# Altium project Thermostat.PrjPCB (part 4 of 4)
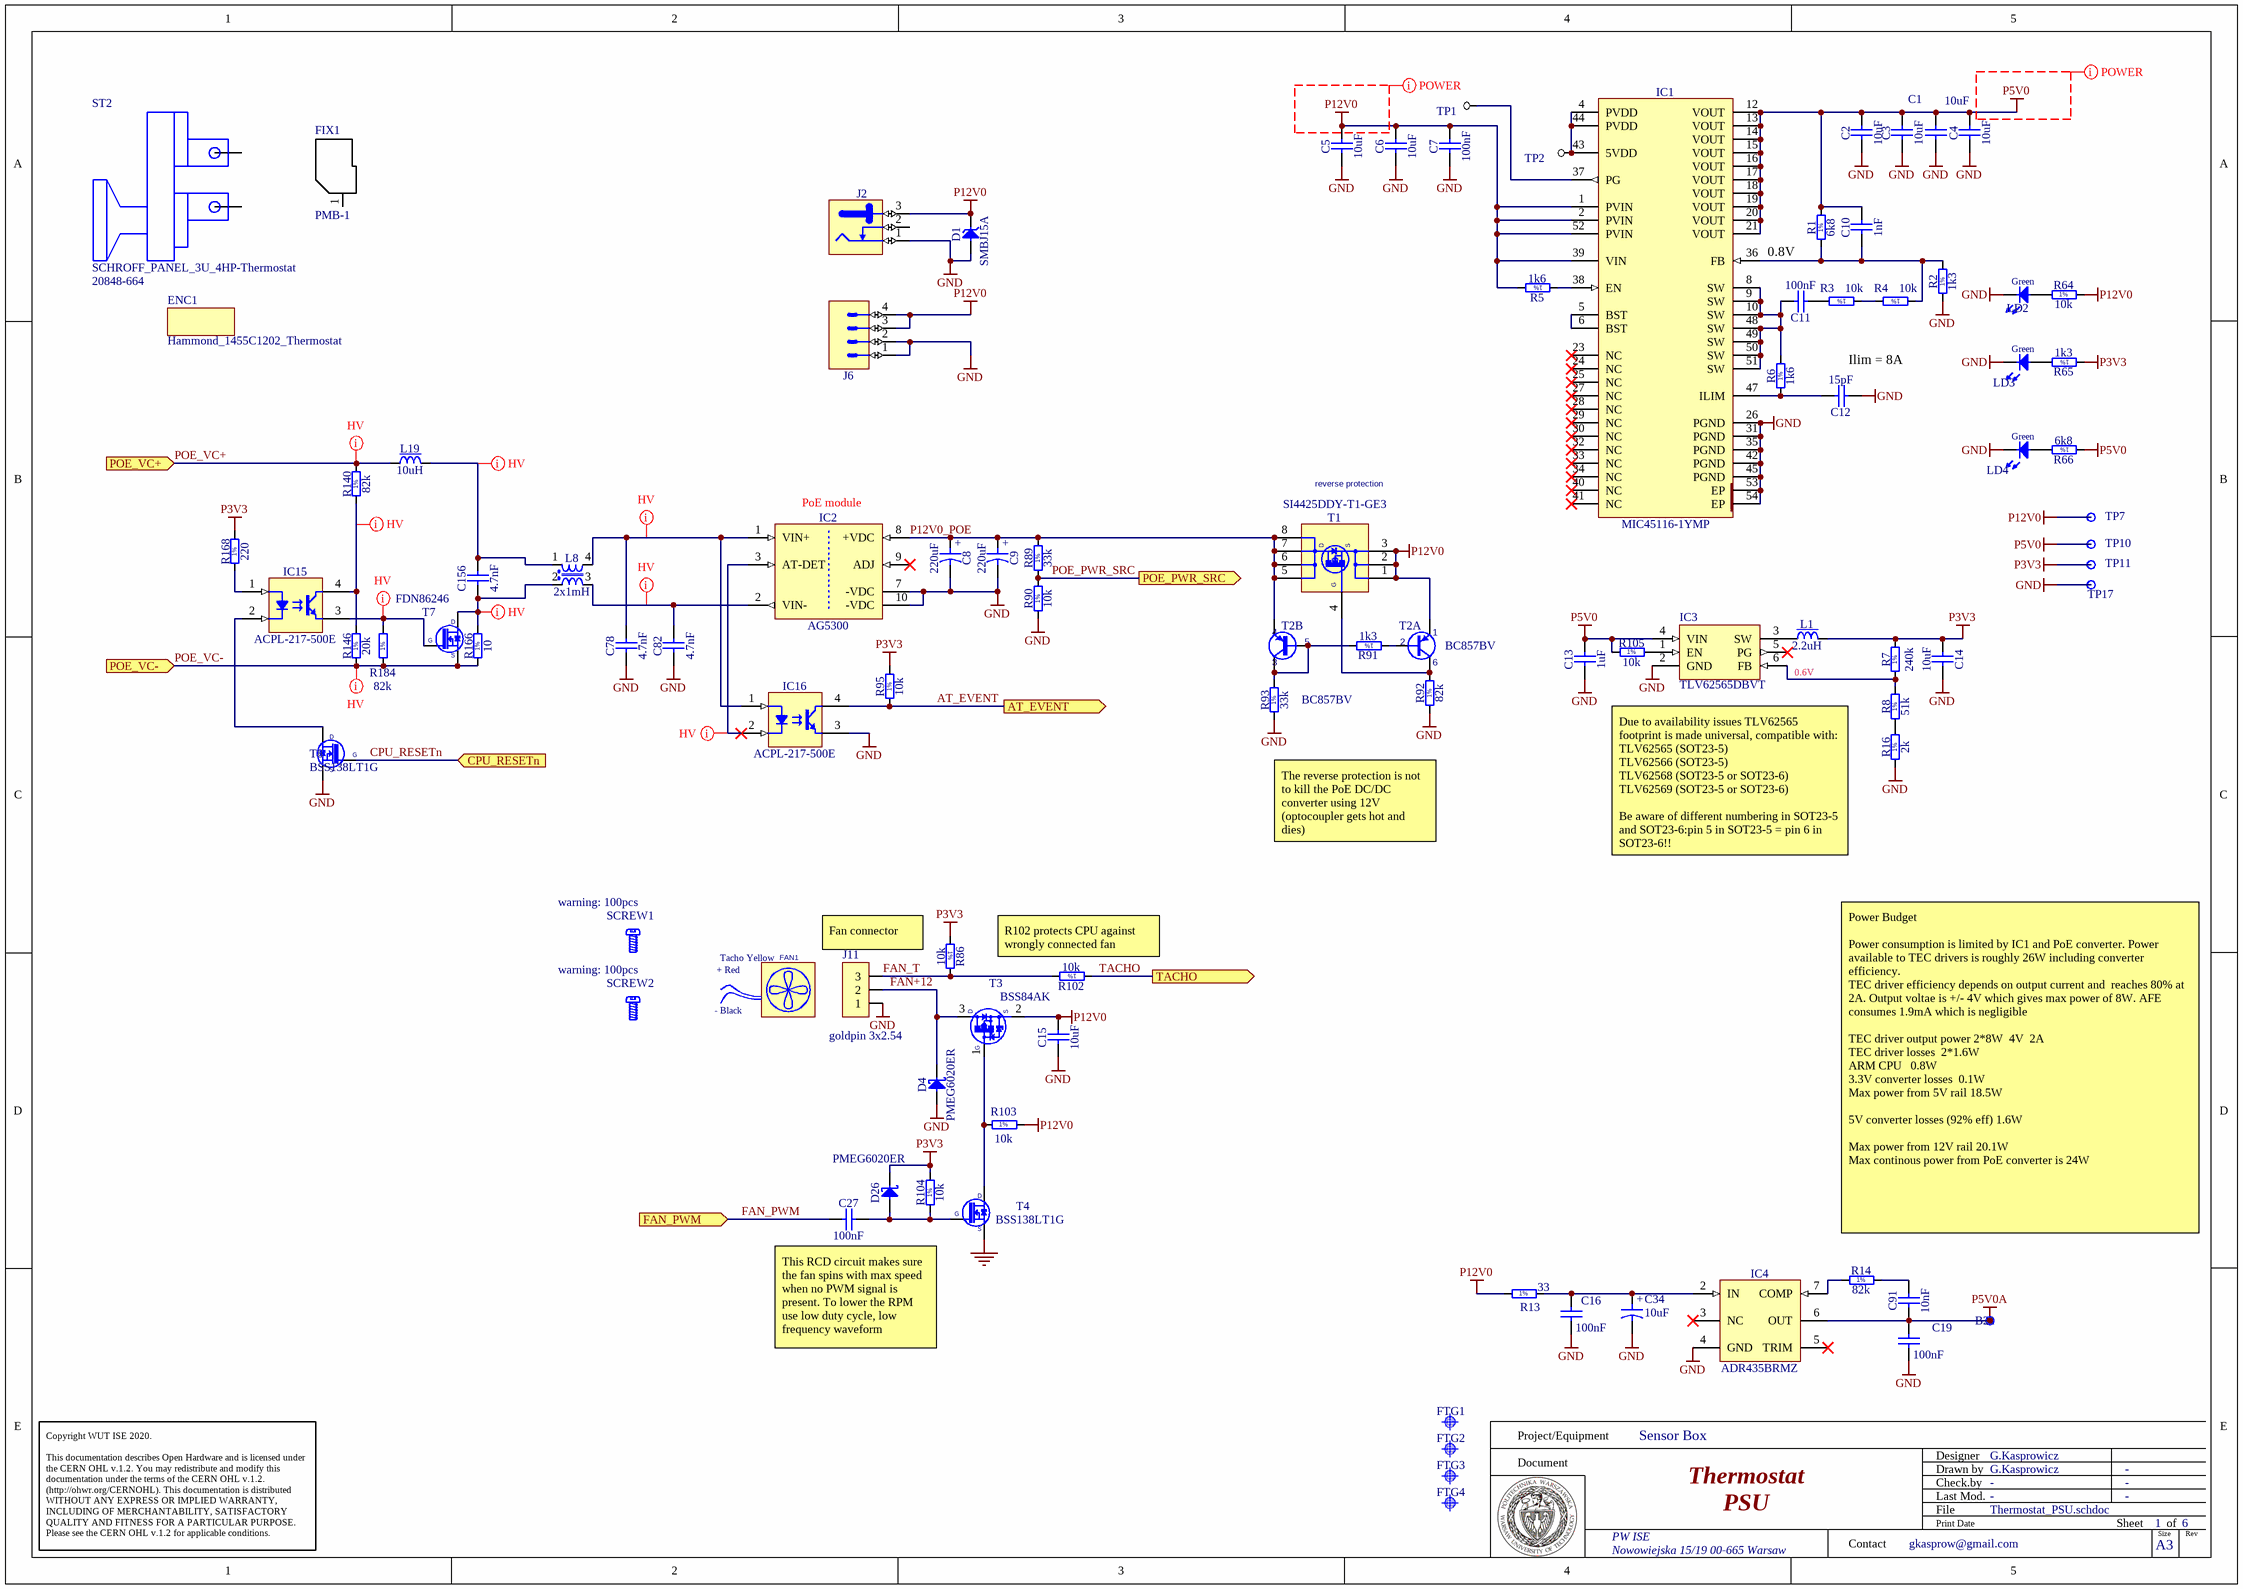
[diagram p7: Thermostat_PSU.schdoc]

## Nets that join several sheets
GND: Thermostat (12 pins), CPU_STM32F4 (54 pins), AFE (34 pins), U_TEC_driver (34 pins), U_TEC_driver (34 pins), RMII_Ethernet (23 pins), USB (6 pins), Thermostat_PSU (47 pins)
P3V3: Thermostat (C101.2 IC17.8 LD1.6 R30.1), CPU_STM32F4 (38 pins), AFE (IC6.3), RMII_Ethernet (8 pins), Thermostat_PSU (10 pins)
P5V0: CPU_STM32F4 (C26.1 IC10.5 R82.1), AFE (R35.1), U_TEC_driver (12 pins), U_TEC_driver (12 pins), Thermostat_PSU (21 pins)
P5V0A: CPU_STM32F4 (R87.2), U_TEC_driver (C20_1.1 C76_1.1 IC5_1.1 IC5_1.2), U_TEC_driver (C20_2.1 C76_2.1 IC5_2.1 IC5_2.2), Thermostat_PSU (B21.1 C19.1 C91.1 IC4.6)
P12V0: Thermostat (R109.2 R110.2), CPU_STM32F4 (R83.2), Thermostat_PSU (22 pins)
~{SHDN}0: Thermostat (R31.2), CPU_STM32F4 (IC9.63)
~{SHDN}0R: Thermostat (D24.2 R31.1), U_TEC_driver (IC18_1.1 R94_1.1)
~{SHDN}1: Thermostat (R85.2), CPU_STM32F4 (IC9.68)
~{SHDN}1R: Thermostat (D25.2 R85.1), U_TEC_driver (IC18_2.1 R94_2.1)
ADC3_IN12: CPU_STM32F4 (IC9.28), U_TEC_driver (B23_1.1 C112_1.2 R77_1.2)
ADC3_IN13: CPU_STM32F4 (IC9.29), U_TEC_driver (B23_2.1 C112_2.2 R77_2.2)
ADC_CSn: Thermostat (B5.1), CPU_STM32F4 (IC9.73), AFE (IC7.14)
ADC_DIN: Thermostat (B6.1), CPU_STM32F4 (IC9.76), AFE (IC7.12)
ADC_DOUT/RDYn: Thermostat (B3.1), CPU_STM32F4 (IC9.75), AFE (IC7.11)
ADC_SCLK: Thermostat (B7.1), CPU_STM32F4 (IC9.69), AFE (IC7.13)
AT_EVENT: CPU_STM32F4 (IC9.58), Thermostat_PSU (IC16.4 R95.1)
CLKIO: CPU_STM32F4 (IC9.81), AFE (IC7.10)
CPU_ADC_REF: Thermostat (B20.1), CPU_STM32F4 (IC10.3 IC10.4 R71.2), U_TEC_driver (R79_1.1), U_TEC_driver (R79_2.1)
CPU_RESETn: CPU_STM32F4 (D5.1 IC13.2), Thermostat_PSU (T8.1)
DAC0_SCLK: CPU_STM32F4 (IC9.1), U_TEC_driver (B12_1.1 IC5_1.6)
DAC0_SDIN: CPU_STM32F4 (IC9.5), U_TEC_driver (B11_1.1 IC5_1.7)
DAC0_SYNCn: CPU_STM32F4 (IC9.3), U_TEC_driver (B13_1.1 IC5_1.5)
DAC1_SCLK: CPU_STM32F4 (IC9.19), U_TEC_driver (B12_2.1 IC5_2.6)
DAC1_SDIN: CPU_STM32F4 (IC9.21), U_TEC_driver (B11_2.1 IC5_2.7)
DAC1_SYNCn: CPU_STM32F4 (IC9.18), U_TEC_driver (B13_2.1 IC5_2.5)
DAC_FB0: CPU_STM32F4 (IC9.40), U_TEC_driver (C89_1.1 R69_1.1)
DAC_FB1: CPU_STM32F4 (IC9.41), U_TEC_driver (C89_2.1 R69_2.1)
FAN_PWM: CPU_STM32F4 (IC9.99), Thermostat_PSU (C27.1)
Freq0: CPU_STM32F4 (IC9.59), U_TEC_driver (IC18_1.3)
Freq1: CPU_STM32F4 (IC9.65), U_TEC_driver (IC18_2.3)
I2C4_SCL: Thermostat (IC17.2), CPU_STM32F4 (5 pins)
I2C4_SDA: Thermostat (IC17.1), CPU_STM32F4 (5 pins)
ITEC0: CPU_STM32F4 (IC9.42), U_TEC_driver (R108_1.1)
ITEC1: CPU_STM32F4 (IC9.46), U_TEC_driver (R108_2.1)
NRST: CPU_STM32F4 (IC9.129), RMII_Ethernet (IC11.15)
OVERTHERMn: Thermostat (5 pins), CPU_STM32F4 (IC9.77)
POE_PWR_SRC: CPU_STM32F4 (IC9.54), Thermostat_PSU (R89.1 R90.2)
POE_VC+: RMII_Ethernet (D7.1 D10.1 D11.1 D22.1), Thermostat_PSU (L19.1 R140.2)
POE_VC-: RMII_Ethernet (D6.2 D8.2 D9.2 D23.2), Thermostat_PSU (R146.1 R166.1 R184.1 T7.2)
PWM_maxINeg0: Thermostat (B1.1), CPU_STM32F4 (IC9.66), U_TEC_driver (R55_1.1)
PWM_maxINeg1: Thermostat (B8.1), CPU_STM32F4 (IC9.67), U_TEC_driver (R55_2.1)
PWM_maxIPos0: Thermostat (B2.1), CPU_STM32F4 (IC9.60), U_TEC_driver (R57_1.1)
PWM_maxIPos1: Thermostat (B9.1), CPU_STM32F4 (IC9.64), U_TEC_driver (R57_2.1)
PWM_maxV0: Thermostat (B4.1), CPU_STM32F4 (IC9.96), U_TEC_driver (R59_1.1)
PWM_maxV1: Thermostat (B10.1), CPU_STM32F4 (IC9.97), U_TEC_driver (R59_2.1)
REF_GND: CPU_STM32F4 (NT1.2), U_TEC_driver (R80_1.1), U_TEC_driver (R80_2.1)
RMII_CRS_DV: CPU_STM32F4 (IC9.43), RMII_Ethernet (R27.1)
RMII_MDC: CPU_STM32F4 (IC9.27), RMII_Ethernet (B16.1 IC11.13)
RMII_MDIO: CPU_STM32F4 (IC9.36), RMII_Ethernet (B17.1 IC11.12 R98.2)
RMII_REF_CLK: CPU_STM32F4 (IC9.35), RMII_Ethernet (R29.1)
RMII_RXD0: CPU_STM32F4 (IC9.44), RMII_Ethernet (R23.1)
RMII_RXD1: CPU_STM32F4 (IC9.45), RMII_Ethernet (R24.1)
RMII_TX_EN: CPU_STM32F4 (IC9.70), RMII_Ethernet (IC11.16)
RMII_TXD0: CPU_STM32F4 (IC9.128), RMII_Ethernet (IC11.17)
RMII_TXD1: CPU_STM32F4 (IC9.74), RMII_Ethernet (IC11.18)
SENS0_1: Thermostat (J1.1 J4.4), AFE (R48.1 R50.2)
SENS0_2: Thermostat (J1.2 J4.5), AFE (R45.1 R46.1)
SENS1_1: Thermostat (J3.1 J5.4), AFE (R42.1 R44.2)
SENS1_2: Thermostat (J3.2 J5.5), AFE (R39.1 R40.1)
STAT1R: Thermostat (LD1.8), CPU_STM32F4 (IC9.78)
STAT3G: Thermostat (LD1.4), CPU_STM32F4 (IC9.79)
STAT4G: Thermostat (LD1.2), CPU_STM32F4 (IC9.80)
SYNC: CPU_STM32F4 (IC9.82), AFE (IC7.15)
TACHO: CPU_STM32F4 (IC9.98), Thermostat_PSU (R102.1)
TEC0_N: Thermostat (J1.4 J1.6 J1.8 J4.1), U_TEC_driver (L3_1.2)
TEC0_P: Thermostat (J1.5 J1.7 J1.9 J4.2), U_TEC_driver (L3_1.3)
TEC1_N: Thermostat (J3.4 J3.6 J3.8 J5.1), U_TEC_driver (L3_2.2)
TEC1_P: Thermostat (J3.5 J3.7 J3.9 J5.2), U_TEC_driver (L3_2.3)
USB_ID: CPU_STM32F4 (IC9.102), USB (C108.2 D21.6 FB2.1)
USB_N: CPU_STM32F4 (IC9.103), USB (D21.4 L9.3)
USB_P: CPU_STM32F4 (IC9.104), USB (D21.3 L9.2)
USB_VBUS: CPU_STM32F4 (R34.2), USB (R73.1 R75.1)
Vref0: CPU_STM32F4 (IC9.34), U_TEC_driver (R107_1.1)
Vref1: CPU_STM32F4 (IC9.37), U_TEC_driver (R107_2.1)

## Assembly variants
Panel: not fitted ENC1 FAN1 IC12 J4 J5 J7 J7 J8 J8 J11 J13 J14 R109 R110 SCREW1 SCREW2 W1 W2
Standalone: not fitted FIX1 IC12 J1 J3 J6 J7 J8 J11 R109 R110 ST2 W1 W2